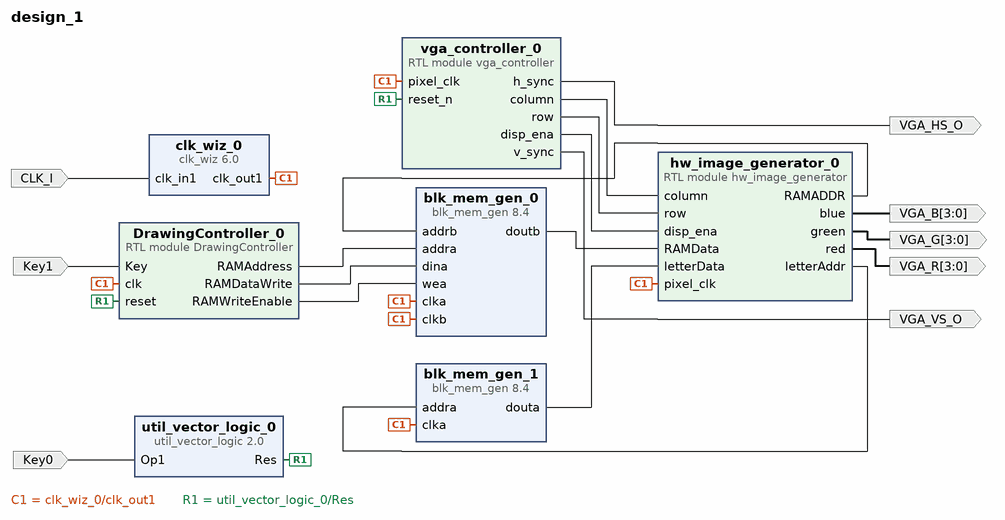
[diagram p0: block diagram of the top level]
# Vivado block design design_1, xc7z007sclg400-1, Vivado 2019.1
create_bd_design design_1

create_bd_port -dir I -type rst Key0
set_property -dict {CONFIG.POLARITY ACTIVE_LOW} [get_bd_ports Key0]
create_bd_port -dir I -type clk CLK_I
set_property -dict {CONFIG.FREQ_HZ 125000000} [get_bd_ports CLK_I]
create_bd_port -dir O VGA_HS_O
create_bd_port -dir O VGA_VS_O
create_bd_port -dir O -from 3 -to 0 VGA_R
create_bd_port -dir O -from 3 -to 0 VGA_G
create_bd_port -dir O -from 3 -to 0 VGA_B
create_bd_port -dir I Key1

create_bd_cell -type ip -vlnv xilinx.com:ip:clk_wiz:6.0 clk_wiz_0
set_property -dict [list \
  CONFIG.CLKIN1_JITTER_PS 80.0 \
  CONFIG.CLKOUT1_DRIVES BUFG \
  CONFIG.CLKOUT1_JITTER 281.423 \
  CONFIG.CLKOUT1_PHASE_ERROR 365.405 \
  CONFIG.CLKOUT1_REQUESTED_OUT_FREQ 25.175 \
  CONFIG.CLKOUT2_DRIVES BUFG \
  CONFIG.CLKOUT3_DRIVES BUFG \
  CONFIG.CLKOUT4_DRIVES BUFG \
  CONFIG.CLKOUT5_DRIVES BUFG \
  CONFIG.CLKOUT6_DRIVES BUFG \
  CONFIG.CLKOUT7_DRIVES BUFG \
  CONFIG.ENABLE_CLOCK_MONITOR false \
  CONFIG.FEEDBACK_SOURCE FDBK_AUTO \
  CONFIG.MMCM_BANDWIDTH OPTIMIZED \
  CONFIG.MMCM_CLKFBOUT_MULT_F 61.500 \
  CONFIG.MMCM_CLKIN1_PERIOD 8.000 \
  CONFIG.MMCM_CLKIN2_PERIOD 10.000 \
  CONFIG.MMCM_CLKOUT0_DIVIDE_F 43.625 \
  CONFIG.MMCM_COMPENSATION ZHOLD \
  CONFIG.MMCM_DIVCLK_DIVIDE 7 \
  CONFIG.PRIMITIVE MMCM \
  CONFIG.PRIM_IN_FREQ 125 \
  CONFIG.USE_LOCKED false \
  CONFIG.USE_RESET false \
] [get_bd_cells clk_wiz_0]
create_bd_cell -type module -reference vga_controller vga_controller_0
create_bd_cell -type ip -vlnv xilinx.com:ip:util_vector_logic:2.0 util_vector_logic_0
set_property -dict {CONFIG.C_OPERATION not CONFIG.C_SIZE 1} [get_bd_cells util_vector_logic_0]
create_bd_cell -type ip -vlnv xilinx.com:ip:blk_mem_gen:8.4 blk_mem_gen_0
set_property -dict [list \
  CONFIG.Assume_Synchronous_Clk true \
  CONFIG.Enable_32bit_Address false \
  CONFIG.Enable_A Always_Enabled \
  CONFIG.Enable_B Use_ENB_Pin \
  CONFIG.Memory_Type Simple_Dual_Port_RAM \
  CONFIG.Operating_Mode_A NO_CHANGE \
  CONFIG.Port_B_Clock 100 \
  CONFIG.Port_B_Enable_Rate 100 \
  CONFIG.Read_Width_B 3 \
  CONFIG.Register_PortB_Output_of_Memory_Primitives false \
  CONFIG.Use_Byte_Write_Enable false \
  CONFIG.Write_Depth_A 65536 \
  CONFIG.Write_Width_A 3 \
  CONFIG.Write_Width_B 3 \
  CONFIG.use_bram_block Stand_Alone \
] [get_bd_cells blk_mem_gen_0]
create_bd_cell -type ip -vlnv xilinx.com:ip:blk_mem_gen:8.4 blk_mem_gen_1
set_property -dict [list \
  CONFIG.Coe_File ../../../../../../CGROM.COE \
  CONFIG.Enable_32bit_Address false \
  CONFIG.Enable_A Always_Enabled \
  CONFIG.Load_Init_File true \
  CONFIG.Memory_Type Single_Port_ROM \
  CONFIG.Port_A_Write_Rate 0 \
  CONFIG.Register_PortA_Output_of_Memory_Primitives true \
  CONFIG.Use_RSTA_Pin false \
  CONFIG.Write_Depth_A 512 \
  CONFIG.Write_Width_A 8 \
  CONFIG.use_bram_block Stand_Alone \
] [get_bd_cells blk_mem_gen_1]
create_bd_cell -type module -reference DrawingController DrawingController_0
create_bd_cell -type module -reference hw_image_generator hw_image_generator_0

# ---- connections ----

connect_bd_net [get_bd_pins clk_wiz_0/clk_out1] \
  [get_bd_pins vga_controller_0/pixel_clk] [get_bd_pins blk_mem_gen_0/clka] [get_bd_pins blk_mem_gen_0/clkb] \
  [get_bd_pins blk_mem_gen_1/clka] [get_bd_pins DrawingController_0/clk] [get_bd_pins hw_image_generator_0/pixel_clk]
connect_bd_net [get_bd_pins vga_controller_0/h_sync] [get_bd_ports VGA_HS_O]
connect_bd_net [get_bd_pins vga_controller_0/v_sync] [get_bd_ports VGA_VS_O]
connect_bd_net [get_bd_pins hw_image_generator_0/red] [get_bd_ports VGA_R]
connect_bd_net [get_bd_pins hw_image_generator_0/green] [get_bd_ports VGA_G]
connect_bd_net [get_bd_pins hw_image_generator_0/blue] [get_bd_ports VGA_B]
connect_bd_net -net Key0_1 [get_bd_ports Key0] [get_bd_pins util_vector_logic_0/Op1]
connect_bd_net [get_bd_pins util_vector_logic_0/Res] [get_bd_pins vga_controller_0/reset_n] [get_bd_pins DrawingController_0/reset]
connect_bd_net [get_bd_pins vga_controller_0/column] [get_bd_pins hw_image_generator_0/column]
connect_bd_net [get_bd_pins vga_controller_0/row] [get_bd_pins hw_image_generator_0/row]
connect_bd_net [get_bd_pins vga_controller_0/disp_ena] [get_bd_pins hw_image_generator_0/disp_ena]
connect_bd_net [get_bd_pins blk_mem_gen_0/doutb] [get_bd_pins hw_image_generator_0/RAMData]
connect_bd_net [get_bd_pins hw_image_generator_0/letterAddr] [get_bd_pins blk_mem_gen_1/addra]
connect_bd_net [get_bd_pins blk_mem_gen_1/douta] [get_bd_pins hw_image_generator_0/letterData]
connect_bd_net [get_bd_pins hw_image_generator_0/RAMADDR] [get_bd_pins blk_mem_gen_0/addrb]
connect_bd_net [get_bd_pins DrawingController_0/RAMAddress] [get_bd_pins blk_mem_gen_0/addra]
connect_bd_net [get_bd_pins DrawingController_0/RAMDataWrite] [get_bd_pins blk_mem_gen_0/dina]
connect_bd_net -net Key_0_1 [get_bd_ports Key1] [get_bd_pins DrawingController_0/Key]
connect_bd_net [get_bd_ports CLK_I] [get_bd_pins clk_wiz_0/clk_in1]
connect_bd_net [get_bd_pins DrawingController_0/RAMWriteEnable] [get_bd_pins blk_mem_gen_0/wea]

validate_bd_design
save_bd_design
